# Altium project PoHalf.PrjPcb
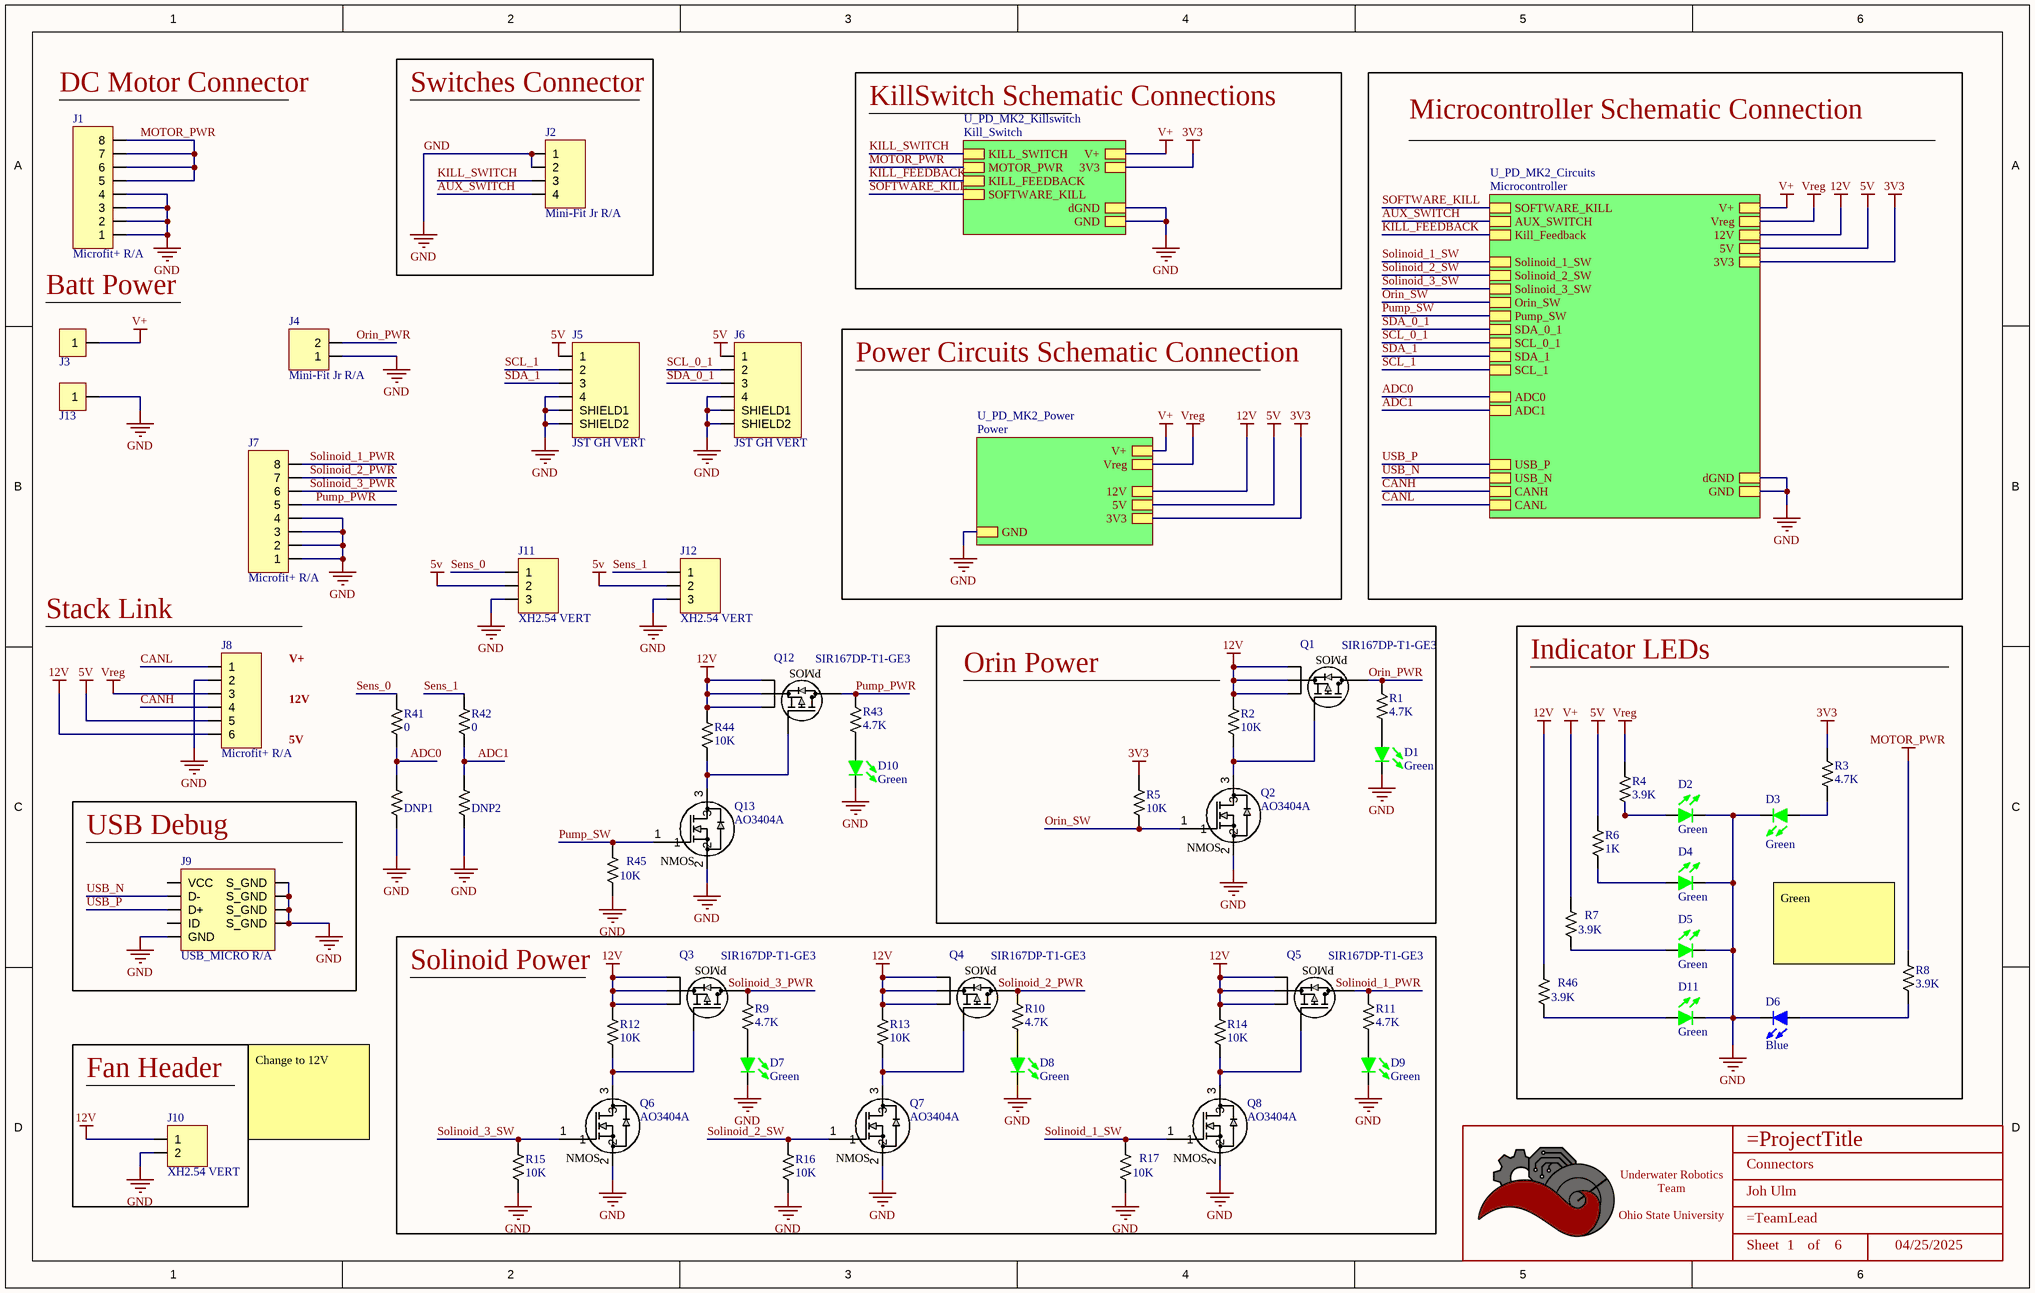
[diagram p0: Connector.SchDoc]
1 sheet, 60 parts. Net scope: hierarchical (ports join the sheet entries above them; power ports are global).
Board file: PoHalf-Small.PcbDoc

## Sheet Connector.SchDoc: Connectors
size B; Date: 04/25/2025; Author: Joh Ulm; Organization: ORGANIZATION; Address1: ADDRESS 1; Address2: ADDRESS 2; Address3: ADDRESS 3; Address4: ADDRESS 4; Revision: -; SheetNumber: 1; SheetTotal: 6; ENG_APP_DATE: --/--/--; DSN_APP_DATE: --/--/--; CHK_APP_DATE: --/--/--

### Parts
*  Title_Block  [LOGO]  (value not drawn)  (graphical)
D1  Color: Green  [LED_0603]  (hidden comment: IN-S63AT5G)
D2  Color: Green  [LED_0603]  (hidden comment: IN-S63AT5G)
D3  Color: Green  [LED_0603]  (hidden comment: IN-S63AT5G)
D4  Color: Green  [LED_0603]  (hidden comment: IN-S63AT5G)
D5  Color: Green  [LED_0603]  (hidden comment: IN-S63AT5G)
D6  Color: Blue  [LED_0603]  (hidden comment: 150060BS75000)
D7  Color: Green  [LED_0603]  (hidden comment: IN-S63AT5G)
D8  Color: Green  [LED_0603]  (hidden comment: IN-S63AT5G)
D9  Color: Green  [LED_0603]  (hidden comment: IN-S63AT5G)
D10  Color: Green  [LED_0603]  (hidden comment: IN-S63AT5G)
D11  Color: Green  [LED_0603]  (hidden comment: IN-S63AT5G)
DNP1  DNP  [RESISTOR_0402]  (value not drawn)
DNP2  DNP  [RESISTOR_0402]  (value not drawn)
J1  Microfit+ R/A  [CONN_MOLEX_MICROFIT+_8POS_R/A]
J2  Mini-Fit Jr R/A  [CONN_MOLEX_MINIFIT JR_4 POS_R/A]
J3  Redcube M4 Term 85A  [Redcube M4 Term 85A]  (value not drawn)
J4  Mini-Fit Jr R/A  [CONN_MOLEX_MINIFIT JR_2 POS_R/A]
J5  JST GH VERT  [CONN_JST_BM04B-GHS-TBT(LF)(SN)(N)]
J6  JST GH VERT  [CONN_JST_BM04B-GHS-TBT(LF)(SN)(N)]
J7  Microfit+ R/A  [CONN_MOLEX_MICROFIT+_8POS_R/A]
J8  Microfit+ R/A  [CONN_MOLEX_MICROFIT_6_POS_R/A]
J9  USB_MICRO R/A  [CONN_MINIUSB]
J10  XH2.54 VERT  [CONN_JST_XH254_2POS_VERT]
J11  XH2.54 VERT  [CONN_JST_XH254_3POS_VERT]
J12  XH2.54 VERT  [CONN_JST_XH254_3POS_VERT]
J13  Redcube M4 Term 85A  [Redcube M4 Term 85A]  (value not drawn)
Q1  SIR167DP-T1-GE3  [MOSFET_7DP-T1-GE3_VIS]
Q2  AO3404A  [SOT-23-3]
Q3  SIR167DP-T1-GE3  [MOSFET_7DP-T1-GE3_VIS]
Q4  SIR167DP-T1-GE3  [MOSFET_7DP-T1-GE3_VIS]
Q5  SIR167DP-T1-GE3  [MOSFET_7DP-T1-GE3_VIS]
Q6  AO3404A  [SOT-23-3]
Q7  AO3404A  [SOT-23-3]
Q8  AO3404A  [SOT-23-3]
Q12  SIR167DP-T1-GE3  [MOSFET_7DP-T1-GE3_VIS]
Q13  AO3404A  [SOT-23-3]
R1  Value  (Ohms): 4.7K  [RESISTOR_0603]  (hidden comment: 4.7k Ohm 5% 1/10W)
R2  Value  (Ohms): 10K  [RESISTOR_0603]  (hidden comment: 10k Ohm 5% 1/10W)
R3  Value  (Ohms): 4.7K  [RESISTOR_0603]  (hidden comment: 4.7k Ohm 5% 1/10W)
R4  Value  (Ohms): 3.9K  [RESISTOR_0603]  (hidden comment: 3.9k Ohm 5% 1/10W)
R5  Value  (Ohms): 10K  [RESISTOR_0603]  (hidden comment: 10k Ohm 5% 1/10W)
R6  Value  (Ohms): 1K  [RESISTOR_0603]  (hidden comment: 1k Ohm 5% 1/8W)
R7  Value  (Ohms): 3.9K  [RESISTOR_0603]  (hidden comment: 3.9k Ohm 5% 1/10W)
R8  Value  (Ohms): 3.9K  [RESISTOR_0603]  (hidden comment: 3.9k Ohm 5% 1/10W)
R9  Value  (Ohms): 4.7K  [RESISTOR_0603]  (hidden comment: 4.7k Ohm 5% 1/10W)
R10  Value  (Ohms): 4.7K  [RESISTOR_0603]  (hidden comment: 4.7k Ohm 5% 1/10W)
R11  Value  (Ohms): 4.7K  [RESISTOR_0603]  (hidden comment: 4.7k Ohm 5% 1/10W)
R12  Value  (Ohms): 10K  [RESISTOR_0603]  (hidden comment: 10k Ohm 5% 1/10W)
R13  Value  (Ohms): 10K  [RESISTOR_0603]  (hidden comment: 10k Ohm 5% 1/10W)
R14  Value  (Ohms): 10K  [RESISTOR_0603]  (hidden comment: 10k Ohm 5% 1/10W)
R15  Value  (Ohms): 10K  [RESISTOR_0603]  (hidden comment: 10k Ohm 5% 1/10W)
R16  Value  (Ohms): 10K  [RESISTOR_0603]  (hidden comment: 10k Ohm 5% 1/10W)
R17  Value  (Ohms): 10K  [RESISTOR_0603]  (hidden comment: 10k Ohm 5% 1/10W)
R41  Value  (Ohms): 0  [RESISTOR_0402]  (hidden comment: 0 Ohm 1% 1/16W)
R42  Value  (Ohms): 0  [RESISTOR_0402]  (hidden comment: 0 Ohm 1% 1/16W)
R43  Value  (Ohms): 4.7K  [RESISTOR_0603]  (hidden comment: 4.7k Ohm 5% 1/10W)
R44  Value  (Ohms): 10K  [RESISTOR_0603]  (hidden comment: 10k Ohm 5% 1/10W)
R45  Value  (Ohms): 10K  [RESISTOR_0603]  (hidden comment: 10k Ohm 5% 1/10W)
R46  Value  (Ohms): 3.9K  [RESISTOR_0603]  (hidden comment: 3.9k Ohm 5% 1/10W)

### Blocks framed on the sheet
Switches Connector: J2
Orin Power: D1 Q1 Q2 R1 R2 R5
Indicator LEDs: D2-D6 D11 R3 R4 R6-R8 R46
USB Debug: J9
Solinoid Power: D7-D9 Q3-Q8 R9-R17
Fan Header: J10

### Sub-sheets
U_PD_MK2_Circuits = Microcontroller (file not in this document): GND, V+, 5V, 3V3, SOFTWARE_KILL, AUX_SWITCH, 12V, dGND, Vreg, USB_P, USB_N, CANH, CANL, Kill_Feedback, Solinoid_1_SW, Solinoid_2_SW, Solinoid_3_SW, Orin_SW, SDA_0_1, SCL_0_1, SDA_1, SCL_1, ADC0, ADC1, Pump_SW
U_PD_MK2_Killswitch = Kill_Switch (file not in this document): KILL_SWITCH, MOTOR_PWR, V+, 3V3, dGND, GND, KILL_FEEDBACK, SOFTWARE_KILL
U_PD_MK2_Power = Power (file not in this document): GND, V+, 5V, 3V3, Vreg, 12V

### Nets
3V3: R3.2 R5.1 ; sheet U_PD_MK2_Power/3V3, sheet U_PD_MK2_Circuits/3V3, sheet U_PD_MK2_Killswitch/3V3
5V: J5.1 J6.1 J8.5 J11.2 J12.2 R6.1 ; sheet U_PD_MK2_Power/5V, sheet U_PD_MK2_Circuits/5V
12V: J8.6 J10.1 Q1.1(S) Q1.2(S) Q1.3(S) Q3.1(S) Q3.2(S) Q3.3(S) Q4.1(S) Q4.2(S) Q4.3(S) Q5.1(S) Q5.2(S) Q5.3(S) Q12.1(S) Q12.2(S) Q12.3(S) R2.1 R12.1 R13.1 R14.1 R44.1 R46.1 ; sheet U_PD_MK2_Power/12V, sheet U_PD_MK2_Circuits/12V
GND: D1.2 D2.2 D3.2 D4.2 D5.2 D6.2 D7.2 D8.2 D9.2 D10.2 D11.2 DNP1.2 DNP2.2 J1.1 J1.2 J1.3 J1.4 J2.1 J2.2 J4.1 J5.4 J5.S1(SHIELD1) J5.S2(SHIELD2) J6.4 J6.S1(SHIELD1) J6.S2(SHIELD2) J7.1 J7.2 J7.3 J7.4 J8.2 J9.5(GND) J9.6(S_GND) J9.7(S_GND) J9.8(S_GND) J9.9(S_GND) J10.2 J11.3 J12.3 J13.1 Q2.2 Q6.2 Q7.2 Q8.2 Q13.2 R15.2 R16.2 R17.2 R45.2 ; sheet U_PD_MK2_Power/GND, sheet U_PD_MK2_Circuits/GND, sheet U_PD_MK2_Circuits/dGND, sheet U_PD_MK2_Killswitch/dGND, sheet U_PD_MK2_Killswitch/GND
MOTOR_PWR: J1.5 J1.6 J1.7 J1.8 R8.1 ; sheet U_PD_MK2_Killswitch/MOTOR_PWR
V+: J3.1 R7.1 ; sheet U_PD_MK2_Power/V+, sheet U_PD_MK2_Circuits/V+, sheet U_PD_MK2_Killswitch/V+
Vreg: J8.3 R4.1 ; sheet U_PD_MK2_Power/Vreg, sheet U_PD_MK2_Circuits/Vreg
ADC0: DNP1.1 R41.2 ; sheet U_PD_MK2_Circuits/ADC0
ADC1: DNP2.1 R42.2 ; sheet U_PD_MK2_Circuits/ADC1
AUX_SWITCH: J2.4 ; sheet U_PD_MK2_Circuits/AUX_SWITCH
CANH: J8.4 ; sheet U_PD_MK2_Circuits/CANH
CANL: J8.1 ; sheet U_PD_MK2_Circuits/CANL
KILL_FEEDBACK: sheet U_PD_MK2_Circuits/Kill_Feedback, sheet U_PD_MK2_Killswitch/KILL_FEEDBACK
KILL_SWITCH: J2.3 ; sheet U_PD_MK2_Killswitch/KILL_SWITCH
Orin_PWR: J4.2 Q1.D R1.2
Orin_SW: Q2.1 R5.2 ; sheet U_PD_MK2_Circuits/Orin_SW
Pump_PWR: J7.5 Q12.D R43.2
Pump_SW: Q13.1 R45.1 ; sheet U_PD_MK2_Circuits/Pump_SW
SCL_0_1: J6.2 ; sheet U_PD_MK2_Circuits/SCL_0_1
SCL_1: J5.2 ; sheet U_PD_MK2_Circuits/SCL_1
SDA_0_1: J6.3 ; sheet U_PD_MK2_Circuits/SDA_0_1
SDA_1: J5.3 ; sheet U_PD_MK2_Circuits/SDA_1
Sens_0: J11.1 R41.1
Sens_1: J12.1 R42.1
SOFTWARE_KILL: sheet U_PD_MK2_Circuits/SOFTWARE_KILL, sheet U_PD_MK2_Killswitch/SOFTWARE_KILL
Solinoid_1_PWR: J7.8 Q5.D R11.2
Solinoid_1_SW: Q8.1 R17.1 ; sheet U_PD_MK2_Circuits/Solinoid_1_SW
Solinoid_2_PWR: J7.7 Q4.D R10.2
Solinoid_2_SW: Q7.1 R16.1 ; sheet U_PD_MK2_Circuits/Solinoid_2_SW
Solinoid_3_PWR: J7.6 Q3.D R9.2
Solinoid_3_SW: Q6.1 R15.1 ; sheet U_PD_MK2_Circuits/Solinoid_3_SW
USB_N: J9.2(D-) ; sheet U_PD_MK2_Circuits/USB_N
USB_P: J9.3(D+) ; sheet U_PD_MK2_Circuits/USB_P
NetD1_1: D1.1 R1.1
NetD2_1: D2.1 R4.2
NetD3_1: D3.1 R3.1
NetD4_1: D4.1 R6.2
NetD5_1: D5.1 R7.2
NetD6_1: D6.1 R8.2
NetD7_1: D7.1 R9.1
NetD8_1: D8.1 R10.1
NetD9_1: D9.1 R11.1
NetD10_1: D10.1 R43.1
NetD11_1: D11.1 R46.2
NetQ1_4: Q1.4(G) Q2.3 R2.2
NetQ3_4: Q3.4(G) Q6.3 R12.2
NetQ4_4: Q4.4(G) Q7.3 R13.2
NetQ5_4: Q5.4(G) Q8.3 R14.2
NetQ12_4: Q12.4(G) Q13.3 R44.2

Not connected (* = marked no-connect by the designer): J9 1(VCC) 4(ID)

### Notes on the sheet
- (near J1) DC Motor Connector
- KillSwitch Schematic Connections
- Microcontroller Schematic Connection
- Batt Power
- Power Circuits Schematic Connection
- (near J8) Stack Link
- V+
- 12V
- 5V
- (near R8) Green
- Change to 12V
- DWG. NO.
- REV.
- SHT.
- THIS DOCUMENT AND THE DATA DISCLOSED HEREIN OR HEREWITH IS THE PROPERTY OF ALTIUM LIMITED AND MAY BE FREELY DISTRIBUTED IN WHOLE. NO RIGHTS ARE RESERVED OR EXPRESS OR IMPLIED WARANTEE GIVEN.
- REVISION
- DESCRIPTION
- DATE
- APPROVED
- ENG:
- APPROVALS
- PROJECT
- DSN:
- CHK:
- REFERENCE DOCUMENTS
- PROJECT REVISION:
- TITLE
- DOCUMENT REVISION:
- DESIGN ITEM:
- BOM:
- FAB DWG:
- PCB DWG:
- ASSY DWG:
- SCALE:
- SIZE
- B
- CAGE CODE
- FILE NAME
- DWG NO.
- SHEET
- OF
- REV
- (in symbol AO3404A) NMOS
- (in symbol SIR167DP-T1-GE3) PMOS
- (in symbol Title_Block) Underwater Robotics Team / Ohio State University; Sheet; of

### Library data of the parts
* = Title_Block: UWRT Schematic Title Block Template / Created June 2021, Dylan Trainor
D1-D5 D7-D11 = LED_Green_0603_3V: LED Green Vf= 3V If = 0.005A / IN-S63AT5G; Made By: Robert Pafford; Forward Current: 5mA; ComponentLink1Description: Datasheet; ComponentLink1URL: https://www.we-online.de/katalog/datasheet/150060GS75000.pdf; Forward Voltage: 3V; Package: 0603; Supplier 1: Digi-Key; Supplier Part Number 1: 1830-1062-1-ND
D6 = LED_Blue_0603: LED Blue Vf= 3.2V If = 0.020A / 150060BS75000; Made By: Robert Pafford; Forward Current: 20mA; Forward Voltage: 3.2V; Package: 0603; Supplier 1: Digi-Key; Supplier Part Number 1: 732-4966-1-ND
DNP1 DNP2 = DNP_0402: Do Not Populate 0402
J1 J7 = CONN_MOLEX_MICROFIT+_8POS_R/A: Molex Microfit+ / 212528 8 POS R/A Black; Current Rating: 12.5A; Pitch: 3.0mm; Supplier 1: Digikey; Supplier Part Number 1: 900-2125280800-ND; Manufacturer: Molex; Configuration: R/A; Color: Black
J2 = CONN_MOLEX_MINIFIT JR_4POS_R/A: Molex Minifit Jr. 5569 / 4 Pos R/A Natural; Pitch: 4.2mm; Configuration: Right Angle; Current Per Pin: 13A; Number of Positions: 4; Supplier Part Number 1: WM13112-ND; Supplier 1: Digi-Key; Manufacturer: Molex; Color: Natural; Created By: Flip B; ComponentLink1Description: Datasheet; ComponentLink1URL: https://www.molex.com/pdm_docs/sd/026013115_sd.pdf; Series: Minifit Jr 5569
J4 = CONN_MOLEX_MINIFIT JR_2POS_R/A: Molex Minifit Jr. 5569 / 2 Pos R/A Natural; Pitch: 4.2mm; Configuration: Right Angle; Current Per Pin: 13A; Number of Positions: 2; Manufacturer: Molex; Color: Natural; Created By: Robert P; ComponentLink1Description: Datasheet; ComponentLink1URL: https://www.molex.com/pdm_docs/sd/026013115_sd.pdf; Series: Minifit Jr 5569; Supplier 1: Digi-Key; Supplier Part Number 1: WM1351-ND
J5 J6 = CONN_JST_GH_4POS_VERT: JST GH Pitch 4 Pos Vertical; Pitch: 1.25mm; Current Per Pin: 1A; Number of Positions: 4; Manufacturer: JST; Configuration: Vertical; Color: Natural; Created By: Robert P; Series: GH; Supplier 1: Digi-Key; Supplier Part Number 1: 455-1580-1-ND
J8 = CONN_MOLEX_MICROFIT+_6POS_R/A: Molex Microfit+ / 212528 6 POS R/A Black; Pitch: 3.0mm; Current Per Pin: 12.5; Supplier 1: Digikey; Supplier Part Number 1: 900-2125280600-ND; Manufacturer: Molex; Configuration: R/A; Color: Black
J9 = CONN_MICROUSB: Amphenol Micro USB-B / USB2.0 5 Pin Right Angle SMD; Pitch: 0.65mm; Current Per Pin: 1.8A; Number of Positions: 5; Manufacturer: Amphenol; Configuration: Right Angle; Color: Silver; Created By: Flip B; ComponentLink1Description: Datasheet; ComponentLink1URL: https://cdn.amphenol-icc.com/media/wysiwyg/files/documentation/datasheet/inputoutput/io_usb_micro.pdf?__cf_chl_jschl_tk__=05693735e19256298f6ef6ca2bb2e65c376a4f56-1625503833-0-Abitsb0-ufjOXJYs_S3J3r2iTn-nObalbmXUksF1VvO_h_WEmRdMlUD1I8-hmWSEVWzY1pirKnrPZWfgY3851qyBZe5ZvnNQePLGIzUgdEIQBVUyW36RsbYpDLEWxJ4horD-5gChFgobLYqwmG5aHl0E8lIn_twwPPrOxilK2gP0q9t_CNOs_u5fMqXvXUrlsOv8tIE2NRlu6NVP8qtkL2GjhlkeTUbDMF8WvvpPDTFOgvZ4Y16Ej8F8AhWos88mo5B1HssXozw0XrkJQIqERITUu6rqloz9kf4ZzhBHtDAt-IkiAFY_Ds9SW8FYKKTtINJVpHZQ6Gyu1FFM4Dc9MO0maE8_mmNcwlxqyRoRk_MPWW8VyByXWM5RSp52jteRKw7FeI9WIYvCbPAOy0Eyib-aseIQsnGbglBcUY6_2xp8GYaJM38H3dNvBPsSOfJBPndKedwKHllxjkucXn6xsN0sDXkpGN-cu8_2bDTJ0g-uUucKSCooYX-ApSDNGpkA_p9zv1SOAD8c0zaZVmtiBsN75QpVz2rzq9_BFxOywPvR; Series: 10118192; Supplier 1: Digi-Key; Supplier Part Number 1: 609-4613-1-ND
J10 = CONN_JST_XH254_2POS_VERT: JST XH 2.54mm Pitch 2 Pos Vertical; Current Per Pin: 4A; Number of Positions: 2; NOTE: Do not use JST 2.5mm parts with this footprint. JST does not make 2.54mm pitch pins, rather only clones make this connector!; Manufacturer: JST; Pitch: 2.54mm; Configuration: Vertical; Color: White; Created By: Robert P; Series: XH 2.54; ComponentLink1Description: Purchase Link; ComponentLink1URL: https://www.amazon.com/460PCS-XH2-54-Connector-Terminal-Connectors/dp/B09DBGVX5C
J11 J12 = CONN_JST_XH254_3POS_VERT: JST XH 2.54mm Pitch 3 Pos Vertical; Current Per Pin: 4A; Number of Positions: 3; NOTE: Do not use JST 2.5mm parts with this footprint. JST does not make 2.54mm pitch pins, rather only clones make this connector!; Manufacturer: JST; Pitch: 2.54mm; Configuration: Vertical; Color: White; Created By: Robert P; Series: XH 2.54; ComponentLink1Description: Purchase Link; ComponentLink1URL: https://www.amazon.com/460PCS-XH2-54-Connector-Terminal-Connectors/dp/B09DBGVX5C
Q1 Q3-Q5 Q12 = SIR167DP-T1-GE3: P-Channel 30 V 60A (Tc) 65.8W (Tc) Surface Mount PowerPAK® SO-8; Mfr_Name: Vishay; Type: DEV; Copyright: Copyright (C) 2022 Ultra Librarian. All rights reserved.; Manufacturer_Part_Number: SIR167DP-T1-GE3; RefDes: RefDes; Supplier 1: Mouser; Supplier Part Number 1: 78-SIR167DP-T1-GE3
Q2 Q6-Q8 Q13 = AO3404A: N-Channel 30 V 5.8A (Ta) 1.4W (Ta) Surface Mount SOT-23-3; Vendor: Alpha & Omega Semiconductor Inc.; SourceLibrary: ON_Semiconductor_2020-01-13; Vgs (Max): 3V @ 5.8A, 10V; Vgs (th): 3V @ 250µA; Vdss: 30V; Rds (on): 28mOhm @ 5.8A, 10V; Amp Rating: 5.8 A; FET Type: N-Channel; Package: SOT23-3L; Manufacturer _Part_Number: AO3404A; Power Dissipation: 1.4W (Ta); Supplier 1: Digi-Key; Supplier Part Number 1: 785-1004-1-ND; Created By: Dylan T
R1 R3 R9-R11 R43 = RESISTOR_4.7K_0603: RES 4.7k OHM 5% 1/10W 0603; Tolerance: +/- 5%; Made By: Robert Pafford; Wattage: 1/10W; Supplier: Digikey; Digikey Part Numer: CR0603-JW-104ELFTR-ND; Supplier 1: Digi-Key; Supplier Part Number 1: RMCF0603JT4K70CT-ND
R2 R5 R12-R17 R44 R45 = RESISTOR_10K_0603: RES 10k OHM 5% 1/10W 0603; Tolerance: +/- 5%; Wattage: 1/8W; Made By: Robert Pafford; ComponentLink1Description: Datasheet; ComponentLink1URL: https://www.bourns.com/docs/product-datasheets/CRxxxxx.pdf; Supplier: Digikey; Digikey Part Numer: CR0603-JW-104ELFTR-ND; Supplier 1: Digi-Key; Supplier Part Number 1: 2019-RK73B1JTTD103JCT-ND
R4 R7 R8 R46 = RESISTOR_3.9K_0603: RES 3.9k OHM 1% 1/10W 0603; Tolerance: +/- 1%; Made By: Robert Pafford; Wattage: 1/10W; Supplier 1: Digi-Key; Supplier Part Number 1: P3.90KHCT-ND
R6 = RESISTOR_1K_0603: RES 1k OHM 5% 1/8W 0603; Tolerance: +/- 5%; Made By: Robert Pafford; ComponentLink1Description: Datasheet; ComponentLink1URL: https://www.bourns.com/docs/product-datasheets/CRxxxxx.pdf; Wattage: 1/8W; Supplier: Digikey; Digikey Part Numer: CR0603-JW-104ELFTR-ND; Supplier 1: Digi-Key; Supplier Part Number 1: 2019-RK73B1JTTD102JCT-ND
R41 R42 = RESISTOR_0_0402: RES 0 OHM 1% 1/16W 0402; Tolerance: +/- 1%; Made By: Robert Pafford; Wattage: 1/16W; Supplier 1: Digikey; Supplier Part Number 1: 13-AC0402FR-070RLCT-ND
J3 J13 = Redcube M4 Term 85A: Created By: Nahtan Ayer; Current Rating: 85 A; Screw Size: M4